# EAGLE design MAX6682_Breakout (EAGLE 9.0.1)
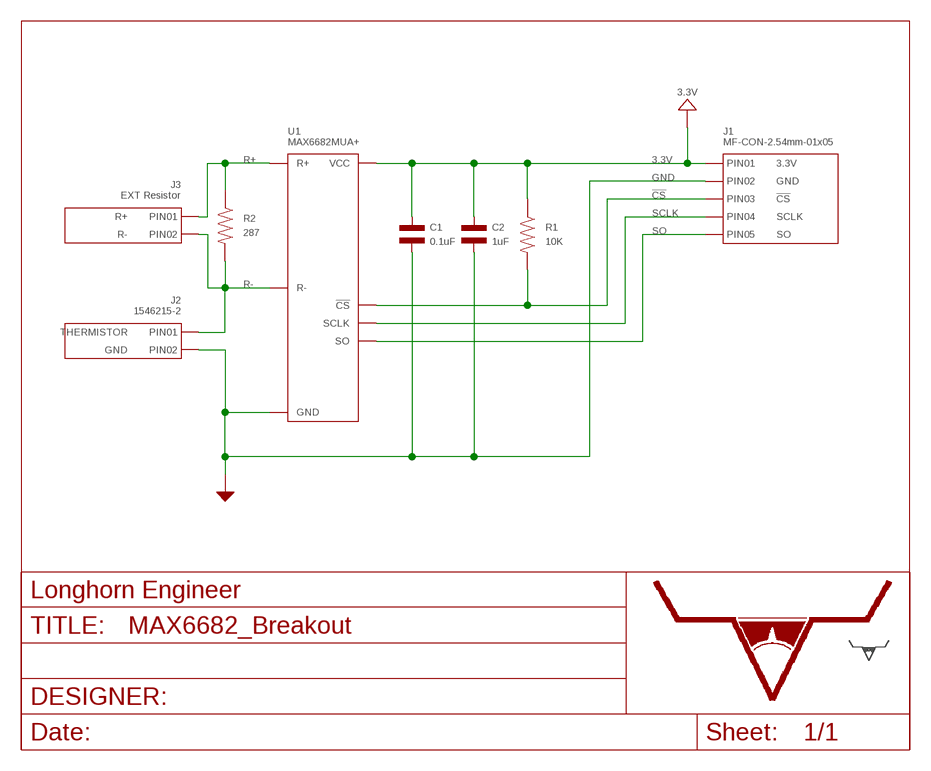
[diagram p0: schematic, sheet 1]

## Parts
C1  0.1uF  CAPACITOR_NP_0603  [C0603]
C2  1uF  CAPACITOR_NP_0603  [C0603]
J1  MF-CON-2.54mm-01x05  CON_01X05_PTH_2.54MM  [PTH_2.54MM_01X05]
J2  1546215-2  CON_01X02_1546215-2  [1546215-2]
J3  EXT Resistor  CON_01X02_2.54MM_PIN_HEADER  [2.54MM_01X02_PIN_HEADER]
R1  10K  RESISTOR_0603  [R0603]
R2  287  RESISTOR_0603  [R0603]
U1  MAX6682MUA+  [MAX6682_UMAX-8]
U$7  LHE_FRAME  [LHE_FRAME]
U$8  LHE_LOGOLHE_LOGO  [LHE_LOGO]

## Nets
3.3V: C1.P$1 C2.P$1 J1.P$1(PIN1) R1.P$1 U1.P$8(VCC)
!CS: J1.P$3(PIN3) R1.P$2 U1.P$5(!CS)
GND: C1.P$2 C2.P$2 J1.P$2(PIN2) J2.P$2(PIN2) U1.P$4(GND)
R+: J3.1(PIN1) R2.P$1 U1.P$2(R+)
R-: J2.P$1(PIN1) J3.2(PIN2) R2.P$2 U1.P$3(R-)
SCLK: J1.P$4(PIN4) U1.P$7(SCLK)
SO: J1.P$5(PIN5) U1.P$6(SO)

## Library data of the parts
C1 C2 = MF_Passives:CAPACITOR_NP: Library: MF_Passives Description: Device for Non-Polarized Capacitors. Manufacture part number (MPN) can be added via Attributes. Check https://factory.macrofab.com/parts for the house parts list.; POPULATE: 1
J1 = MF_Connectors:CON_01X05: Library: MF_Connectors Description: Header Connector with 5 Positions and 01 Rows. Use the LABEL Attribute to label the pin on the schematic and PCB. You can remove the attributes on the PCB by using the SMASH function on the part and then deleting the text.; HOUSEPART: YES; LABEL01: 3.3V; LABEL02: GND; LABEL03: !CS; LABEL04: SCLK; LABEL05: SO; MPN: MF-CON-2.54mm-01x05; POPULATE: 1; URL: https://factory.macrofab.com/part/MF-CON-2.54mm-01x05
J2 = PP_Connectors:CON_01X02; LABEL01: THERMISTOR; LABEL02: GND; POPULATE: 1
J3 = PP_Connectors:CON_01X02; LABEL01: R+; LABEL02: R-; POPULATE: 1
R1 = MF_Passives:RESISTOR: Library: MF_Passives Description: Device for Resistors. Manufacture part number (MPN), Voltage, Tolerance, and Wattage Rating can be added via Attributes. Check https://factory.macrofab.com/parts for the house parts list.; POPULATE: 1
R2 = MF_Passives:RESISTOR: Library: MF_Passives Description: Device for Resistors. Manufacture part number (MPN), Voltage, Tolerance, and Wattage Rating can be added via Attributes. Check https://factory.macrofab.com/parts for the house parts list.; MPN: ERA-3AEB2870V; POPULATE: 1
U1 = PP_Sensors:MAX6682
U$7 = PP_Aesthetics:LHE_FRAME; DNAME: Parker Dillmann; REVNUM: REV: 1
U$8 = PP_Aesthetics:LHE_LOGO

## Board
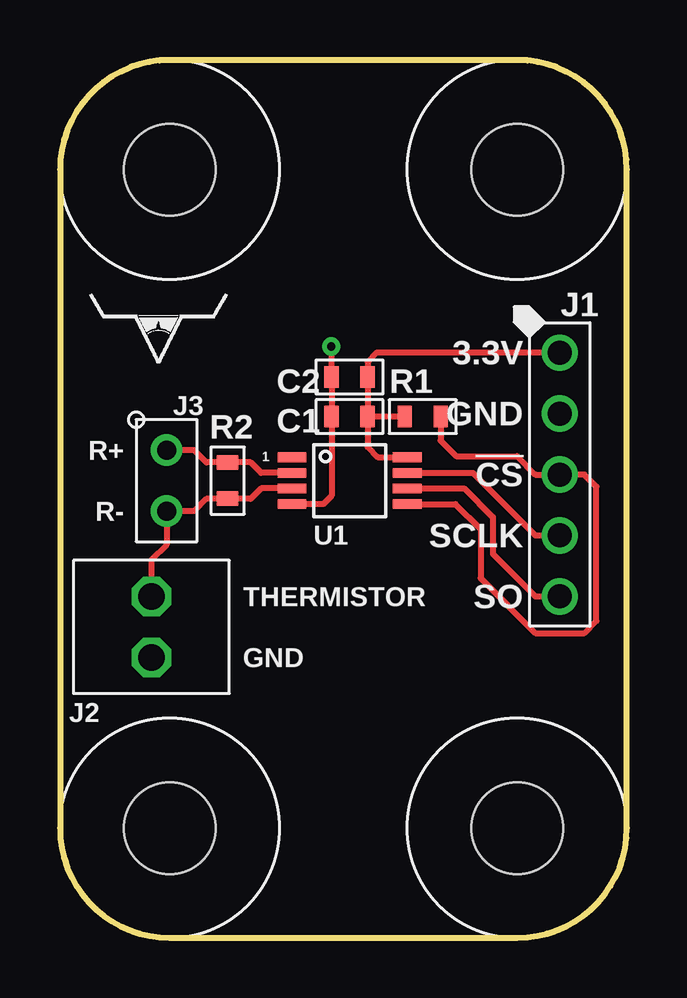
[diagram p1: board, top side]
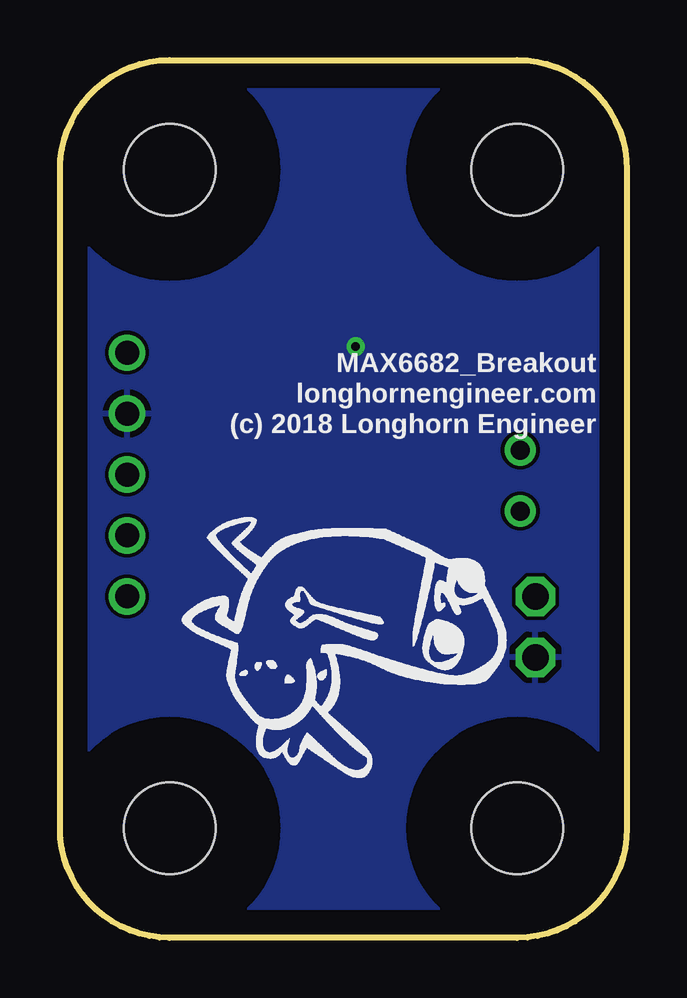
[diagram p2: board, bottom side, seen from below]

Size 23.62 x 36.58 mm. Coordinates in mm from the lower left corner, seen from the top.
Outline: 23.62,4.57 23.62,32 arc90 19.05,36.58 4.57,36.58 arc90 0,32 0,4.57 arc90 4.57,0 19.05,0 arc90 23.62,4.57
Copper layers (1*16): Top 0.035mm / dielectric 1.5mm / Bottom 0.035mm
Design rules "default": minimum track width 6mil, minimum drill 0.35mm, track to track 6mil, track to pad 6mil, pad to pad 6mil, via to via 6mil, smd to smd 6mil, copper to edge 40mil, drill to drill 6mil, minimum pad ring 10mil, minimum via ring 8mil, stop-mask expansion 4mil, vias tented up to drill 0mil, thermal gap 10mil

### Footprints (pad centres in the part's own frame; a part is rotated, then mirrored left to right if it is on the bottom)
C0603 = smd 0.6 x 0.9: P$1 -0.75,0; P$2 0.75,0
PTH_2.54MM_01X05 = drill 1: P$1 -5.08,0; P$2 -2.54,0; P$3 0,0; P$4 2.54,0; P$5 5.08,0
1546215-2 = drill 1.1 octagon: P$1 -1.27,0; P$2 1.27,0
2.54MM_01X02_PIN_HEADER = drill 0.8: 1 -1.27,0; 2 1.27,0
R0603 = smd 0.6 x 0.9: P$1 -0.75,0; P$2 0.75,0
MAX6682_UMAX-8 = smd 1.2 x 0.4: P$1 -2.4,0.975; P$2 -2.4,0.325; P$3 -2.4,-0.325; P$4 -2.4,-0.975; P$5 2.4,-0.975; P$6 2.4,-0.325; P$7 2.4,0.325; P$8 2.4,0.975
MOUNT_HOLE_150MIL = hole 3.81: 0,0

### Placement (x,y rotation side)
C1  12.06,21.72 180 top
C2  12.06,23.37 180 top
J1  20.83,19.3 270 top
J2  3.81,12.95 270 top
J3  4.45,19.05 270 top
R1  15.11,21.72 0 top
R2  6.99,19.05 270 top
U1  12.06,19.05 0 top
U$3  [MOUNT_HOLE_150MIL]  4.57,4.57 0 top
U$4  [MOUNT_HOLE_150MIL]  19.05,4.57 0 top
U$5  [MOUNT_HOLE_150MIL]  19.05,32 0 top
U$6  [MOUNT_HOLE_150MIL]  4.57,32 0 top
U$7  1.27,26.92 180 bottom
U$8  6.1,23.88 0 top
U$9  [DB_SILK_MEDIUM]  18.54,17.53 270 bottom

### Tracks (layer width: path | path; a pad name or v marks a point on that pad's centre or on a via)
3.3V
  Top 0.254: C1.P$1 C2.P$1 12.81,23.99 13.21,24.38 J1.P$1 | C1.P$1 12.81,20.46 13.25,20.02 U1.P$8 | R1.P$1 C1.P$1
!CS
  Top 0.254: U1.P$5 16.47,18.07 17.53,17.02 17.53,14.99 19.81,12.7 21.84,12.7 22.35,13.21 22.35,18.8 21.84,19.3 J1.P$3 19.81,19.3 19.05,20.07 16.51,20.07 15.86,20.71 R1.P$2
GND  (via drill 0.35)
  Top 0.254: U1.P$4 10.96,18.07 11.31,18.43 C1.P$2 C2.P$2 v11.3,24.64
  pour Bottom: 0,0 0,36.58 23.62,36.58 23.62,0
R+
  Top 0.254: U1.P$2 8.38,19.38 7.95,19.81 6.99,19.81 | 6.99,19.81 R2.P$1 | 6.99,19.81 6.1,19.81 5.59,20.32 J3.1
R-
  Top 0.254: U1.P$3 8.38,18.73 7.95,18.29 6.99,18.29 | 6.99,18.29 R2.P$2 | 6.99,18.29 6.1,18.29 5.59,17.78 J3.2 4.45,16.38 3.81,15.75 J2.P$1
SCLK
  Top 0.254: U1.P$7 17.2,19.38 18.54,18.03 19.81,16.76 J1.P$4
SO
  Top 0.254: U1.P$6 16.84,18.73 18.03,17.53 18.03,16 19.81,14.22 J1.P$5